# Altium project PowerDistributionBoard.PrjPcb
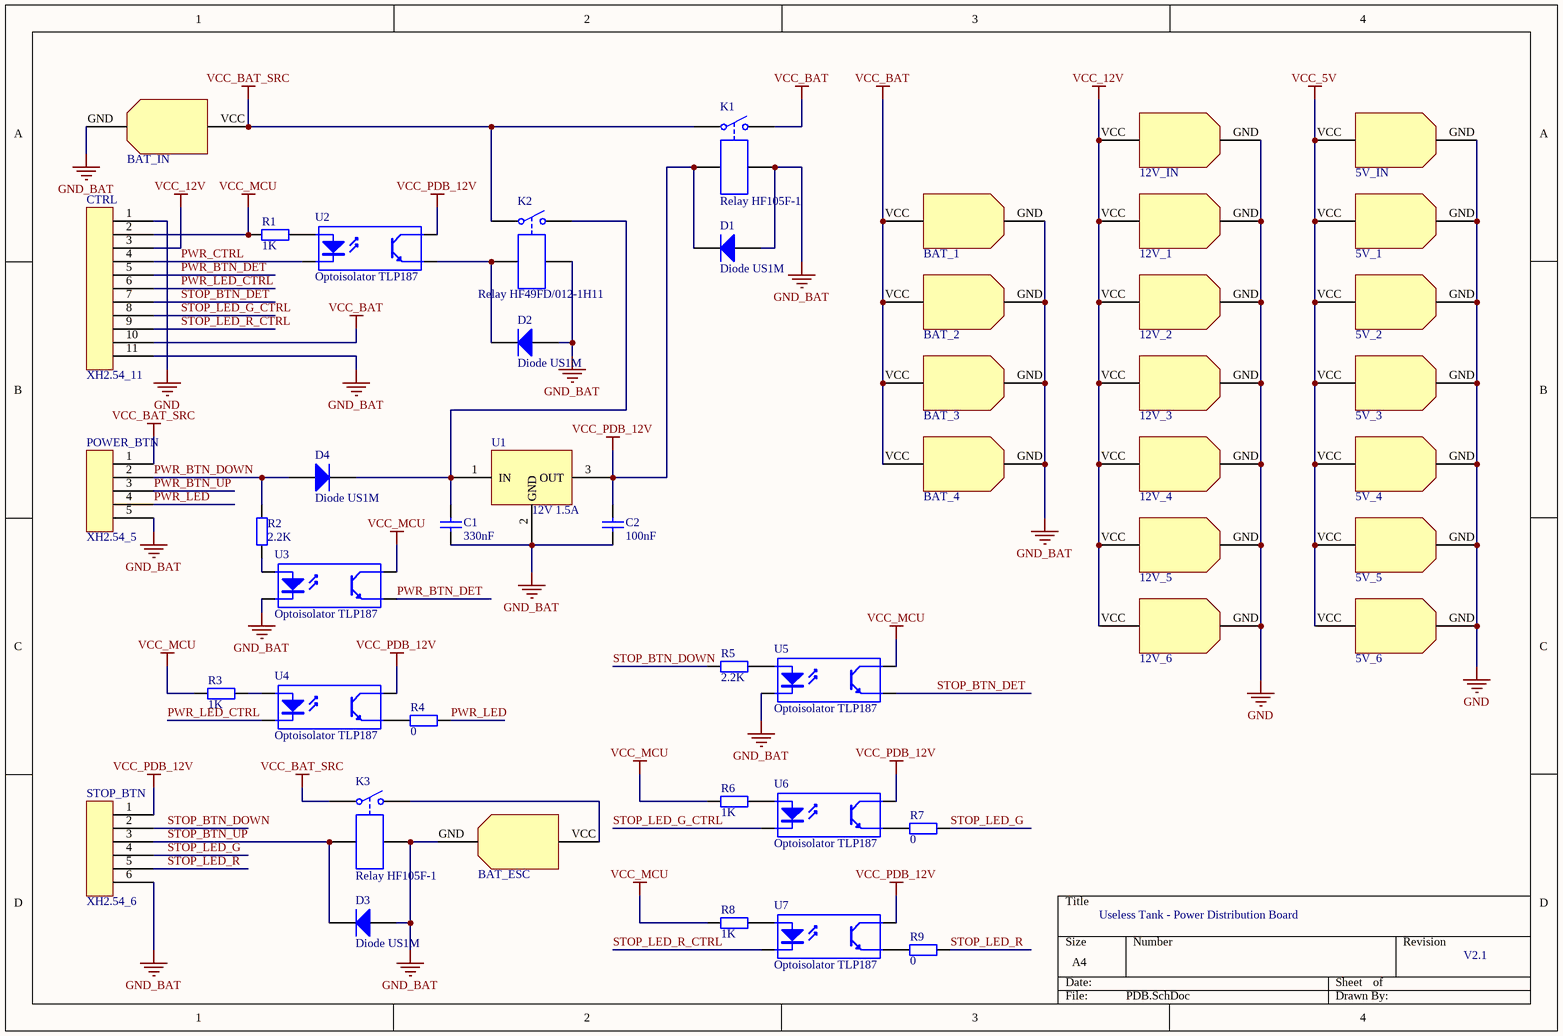
[diagram p0: PDB.SchDoc]
Version: V2.1
1 sheet, 48 parts. Net scope: global (net labels, ports and power ports of the same name join across sheets).
Board file: PDB.PcbDoc

## Sheet PDB.SchDoc: Useless Tank - Power Distribution Board
size A4; Revision: 2.0; PageSetup: Record=PageOptions|CenterHorizontal=True|CenterVertical=True|PrintScale=1.00|XCorrection=1.00|YCorrection=1.00|PrintKind=0|BorderSize=5000000|LeftOffset=0|BottomOffset=0|Orientation=2|PaperLength=1000|PaperWidth=1000|Scale=100|PaperSource=7|PrintQuality=-3|MediaType=1|DitherType=10|PrintScaleMode=1|PaperKind=A4|PaperIndex=9

### Parts
5V_1  XT30/60/90  [XT30UPB-F]  (value not drawn)
5V_2  XT30/60/90  [XT30UPB-F]  (value not drawn)
5V_3  XT30/60/90  [XT30UPB-F]  (value not drawn)
5V_4  XT30/60/90  [XT30UPB-F]  (value not drawn)
5V_5  XT30/60/90  [XT30UPB-F]  (value not drawn)
5V_6  XT30/60/90  [XT30UPB-F]  (value not drawn)
5V_IN  XT30/60/90  [XT60PB-M]  (value not drawn)
12V_1  XT30/60/90  [XT60PB-F]  (value not drawn)
12V_2  XT30/60/90  [XT30UPB-F]  (value not drawn)
12V_3  XT30/60/90  [XT30UPB-F]  (value not drawn)
12V_4  XT30/60/90  [XT30UPB-F]  (value not drawn)
12V_5  XT30/60/90  [XT30UPB-F]  (value not drawn)
12V_6  XT30/60/90  [XT30UPB-F]  (value not drawn)
12V_IN  XT30/60/90  [XT60PB-M]  (value not drawn)
BAT_1  XT30/60/90  [XT60PB-F]  (value not drawn)
BAT_2  XT30/60/90  [XT60PB-F]  (value not drawn)
BAT_3  XT30/60/90  [XT30UPB-F]  (value not drawn)
BAT_4  XT30/60/90  [XT30UPB-F]  (value not drawn)
BAT_ESC  XT30/60/90  [XT60PB-F]  (value not drawn)
BAT_IN  XT30/60/90  [XT60PB-M]  (value not drawn)
C1  value 330nF  [CAP0805_M]  (hidden comment: Cap)
C2  value 100nF  [CAP0805_M]  (hidden comment: Cap)
CTRL  XH2.54_11  [XH_TH_TOP_11]
D1  Diode US1M  [DO-214AC]
D2  Diode US1M  [DO-214AC]
D3  Diode US1M  [DO-214AC]
D4  Diode US1M  [DO-214AC]
K1  Relay HF105F-1  [HF105F-1]
K2  Relay HF49FD/012-1H11  [HF49FD/xxx-1Hx1]
K3  Relay HF105F-1  [HF105F-1]
POWER_BTN  XH2.54_5  [XH_TH_TOP_5]
R1  value 1K  [RES0805_M]  (hidden comment: Res2)
R2  value 2.2K  [RES0805_M]  (hidden comment: Res2)
R3  value 1K  [RES0805_M]  (hidden comment: Res2)
R4  value 0  [RES1206_M]  (hidden comment: Res2)
R5  value 2.2K  [RES0805_M]  (hidden comment: Res2)
R6  value 1K  [RES0805_M]  (hidden comment: Res2)
R7  value 0  [RES1206_M]  (hidden comment: Res2)
R8  value 1K  [RES0805_M]  (hidden comment: Res2)
R9  value 0  [RES1206_M]  (hidden comment: Res2)
STOP_BTN  XH2.54_6  [XH_TH_TOP_6]
U1  12V 1.5A  [CJ7812_TO-252-2L]
U2  Optoisolator TLP187  [TLP187]
U3  Optoisolator TLP187  [TLP187]
U4  Optoisolator TLP187  [TLP187]
U5  Optoisolator TLP187  [TLP187]
U6  Optoisolator TLP187  [TLP187]
U7  Optoisolator TLP187  [TLP187]

### Nets
GND: 5V_1.GND 5V_2.GND 5V_3.GND 5V_4.GND 5V_5.GND 5V_6.GND 5V_IN.GND 12V_1.GND 12V_2.GND 12V_3.GND 12V_4.GND 12V_5.GND 12V_6.GND 12V_IN.GND CTRL.1
GND_BAT: BAT_1.GND BAT_2.GND BAT_3.GND BAT_4.GND BAT_ESC.GND BAT_IN.GND C1.1 C2.1 CTRL.11 D1.2(A) D2.2(A) D3.2(A) K1.4 K2.4 K3.4 POWER_BTN.5 STOP_BTN.6 U1.2(GND) U3.2(K) U5.2(K)
VCC_5V: 5V_1.VCC 5V_2.VCC 5V_3.VCC 5V_4.VCC 5V_5.VCC 5V_6.VCC 5V_IN.VCC
VCC_12V: 12V_1.VCC 12V_2.VCC 12V_3.VCC 12V_4.VCC 12V_5.VCC 12V_6.VCC 12V_IN.VCC CTRL.3
VCC_BAT: BAT_1.VCC BAT_2.VCC BAT_3.VCC BAT_4.VCC CTRL.10 K1.2
VCC_BAT_SRC: BAT_IN.VCC K1.1 K2.1 K3.1 POWER_BTN.1
VCC_MCU: CTRL.2 R1.1 R3.1 R6.1 R8.1 U3.4(C) U5.4(C)
VCC_PDB_12V: C2.2 D1.1(K) K1.3 STOP_BTN.1 U1.3(OUT) U2.4(C) U4.4(C) U6.4(C) U7.4(C)
PWR_BTN_DET: CTRL.5 U3.3(E)
PWR_BTN_DOWN: D4.2(A) POWER_BTN.2 R2.2
PWR_BTN_UP: POWER_BTN.3
PWR_CTRL: CTRL.4 U2.2(K)
PWR_LED: POWER_BTN.4 R4.2
PWR_LED_CTRL: CTRL.6 U4.2(K)
STOP_BTN_DET: CTRL.7 U5.3(E)
STOP_BTN_DOWN: R5.1 STOP_BTN.2
STOP_BTN_UP: D3.1(K) K3.3 STOP_BTN.3
STOP_LED_G: R7.1 STOP_BTN.4
STOP_LED_G_CTRL: CTRL.8 U6.2(K)
STOP_LED_R: R9.2 STOP_BTN.5
STOP_LED_R_CTRL: CTRL.9 U7.2(K)
NetBAT_ESC_VCC: BAT_ESC.VCC K3.2
NetC1_2: C1.2 D4.1(K) K2.2 U1.1(IN)
NetD2_1: D2.1(K) K2.3 U2.3(E)
NetR1_2: R1.2 U2.1(A)
NetR2_1: R2.1 U3.1(A)
NetR3_2: R3.2 U4.1(A)
NetR4_1: R4.1 U4.3(E)
NetR5_2: R5.2 U5.1(A)
NetR6_2: R6.2 U6.1(A)
NetR7_2: R7.2 U6.3(E)
NetR8_2: R8.2 U7.1(A)
NetR9_1: R9.1 U7.3(E)

### Library data of the parts
C1 C2 = Cap: Capacitor; Published: 8-Jun-2000; LatestRevisionDate: 17-Jul-2002; LatestRevisionNote: Re-released for DXP Platform.; PackageReference: RAD-0.3; Publisher: Altium Limited; PackageDescription: Radial Cap, Thru-Hole; 2 Leads; 0.3 in Pin Spacing
D1-D4 = Diode US1M: High Conductance Fast Diode; Published: 8-Jun-2000; LatestRevisionDate: 17-Jul-2002; LatestRevisionNote: Re-released for DXP Platform.; DatasheetVersion: 1997; PackageReference: DO-35; Publisher: Altium Limited; PackageDescription: Diode, Axial; Body 3.8 x 1.9 mm (LxDia. max), Lead Dia. 0.53 mm (max); Code_JEDEC: DO-204-AH; ComponentLink1Description: Manufacturer Link; ComponentLink1URL: http://www.fairchildsemi.com/; ComponentLink2Description: Datasheet; ComponentLink2URL: http://www.fairchildsemi.com/ds/1N%2F1N4148.pdf
K1 K3 = Relay HF105F-1: 30A Single-Pole Single-Throw Relay; Published: 24-Mar-1999; LatestRevisionDate: 17-Jul-2002; LatestRevisionNote: Re-released for DXP Platform.; PackageReference: MODULE4; Publisher: Altium Limited
K2 = Relay HF49FD/012-1H11: 5A Single-Pole Single-Throw Relay; Published: 24-Mar-1999; LatestRevisionDate: 17-Jul-2002; LatestRevisionNote: Re-released for DXP Platform.; PackageReference: MODULE4; Publisher: Altium Limited
R1-R9 = Res2: Resistor; Published: 8-Jun-2000; LatestRevisionDate: 17-Jul-2002; LatestRevisionNote: Re-released for DXP Platform.; PackageReference: AXIAL-0.4; Publisher: Altium Limited; PackageDescription: Axial Device, Thru-Hole; 2 Leads; 0.4 in Pin Spacing
U1 = CJ7812: Voltage Regulator 12V 1.5A
U2-U7 = Optoisolator TLP187: 4-Pin Phototransistor Optocoupler; Published: 24-Mar-1999; LatestRevisionDate: 04-Mar-2005; LatestRevisionNote: Sch pins 3 & 4 Swapped.; DatasheetVersion: Nov-2003; PackageReference: DIP-4; Publisher: Altium Limited